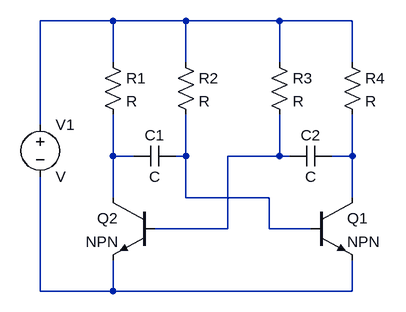
[diagram p0: schematic Draft3.asc]
Draft3.asc, the LTspice schematic file:
Version 4
SHEET 1 880 680
WIRE 208 -32 96 -32
WIRE 320 -32 208 -32
WIRE 464 -32 320 -32
WIRE 576 -32 464 -32
WIRE 208 32 208 -32
WIRE 320 32 320 -32
WIRE 464 32 464 -32
WIRE 576 32 576 -32
WIRE 96 128 96 -32
WIRE 208 176 208 112
WIRE 240 176 208 176
WIRE 320 176 320 112
WIRE 320 176 304 176
WIRE 464 176 464 112
WIRE 464 176 384 176
WIRE 480 176 464 176
WIRE 576 176 576 112
WIRE 576 176 544 176
WIRE 208 240 208 176
WIRE 320 240 320 176
WIRE 448 240 320 240
WIRE 576 240 576 176
WIRE 384 288 384 176
WIRE 384 288 272 288
WIRE 448 288 448 240
WIRE 512 288 448 288
WIRE 96 384 96 208
WIRE 208 384 208 336
WIRE 208 384 96 384
WIRE 576 384 576 336
WIRE 576 384 208 384
SYMBOL voltage 96 112 R0
SYMATTR InstName V1
SYMBOL res 192 16 R0
SYMATTR InstName R1
SYMBOL res 304 16 R0
SYMATTR InstName R2
SYMBOL res 448 16 R0
SYMATTR InstName R3
SYMBOL res 560 16 R0
SYMATTR InstName R4
SYMBOL cap 304 160 R90
WINDOW 0 0 32 VBottom 2
WINDOW 3 32 32 VTop 2
SYMATTR InstName C1
SYMBOL cap 544 160 R90
WINDOW 0 0 32 VBottom 2
WINDOW 3 32 32 VTop 2
SYMATTR InstName C2
SYMBOL npn 512 240 R0
SYMATTR InstName Q1
SYMBOL npn 272 240 M0
SYMATTR InstName Q2

The netlist it stands for:
* Draft3.asc
V1 N001 N006 V
R1 N001 N002 R
R2 N001 N003 R
R3 N001 N004 R
R4 N001 N005 R
C1 N003 N002 C
C2 N005 N004 C
Q1 N005 N003 N006 0 NPN
Q2 N002 N004 N006 0 NPN
.model NPN NPN
.model PNP PNP
.lib standard.bjt
.backanno
.end